# Altium schematic sheet Mosfets.SchDoc
size A4; SheetNumber: 6; SheetTotal: 9
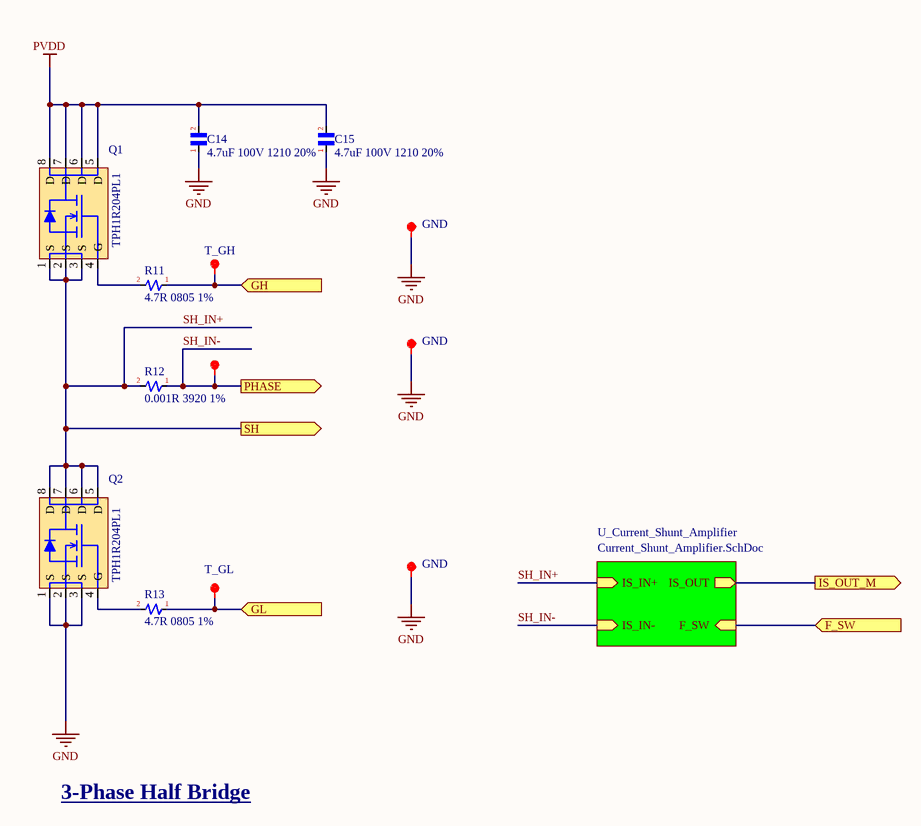
[diagram p0: Mosfets.SchDoc]

## Parts
C14  4.7uF 100V 1210 20%  [C_1210]
C15  4.7uF 100V 1210 20%  [C_1210]
Q1  TPH1R204PL1  [TRANS_STL60P4LLF6]
Q2  TPH1R204PL1  [TRANS_STL60P4LLF6]
R11  4.7R 0805 1%  [R_0805]
R12  0.001R 3920 1%  [R_3920]
R13  4.7R 0805 1%  [R_0805]
TP22  T_GH  [TP_1mm_SMD]  (graphical)
TP25  GND  [TP_1mm_SMD]  (graphical)
TP28  GND  [TP_1mm_SMD]  (graphical)
TP31  (no value)  [TP_1mm_SMD]  (graphical)
TP34  T_GL  [TP_1mm_SMD]  (graphical)
TP37  GND  [TP_1mm_SMD]  (graphical)

## Sub-sheets
U_Current_Shunt_Amplifier = Current_Shunt_Amplifier.SchDoc: IS_OUT (out), IS_IN+ (in), IS_IN- (in), F_SW (in)

## Ports
F_SW (in, see TurboSpin[3C], Current_Shunt_Amplifier[4C], Mcu[3C]), GH (in, see TurboSpin[3C]), GL (in, see TurboSpin[3C]), IS_OUT_M (out, see TurboSpin[3C]), PHASE (out, see TurboSpin[3C]), SH (out, see TurboSpin[3C])

## Nets
GND: C14.1 C15.1 Q2.1(S) Q2.2(S) Q2.3(S) TP25.1 TP28.1 TP37.1
PVDD: C14.2 C15.2 Q1.5(D) Q1.6(D) Q1.7(D) Q1.8(D)
F_SW: port F_SW, sheet U_Current_Shunt_Amplifier/F_SW
GH: R11.1 TP22.1 ; port GH
GL: R13.1 TP34.1 ; port GL
IS_OUT_M: port IS_OUT_M, sheet U_Current_Shunt_Amplifier/IS_OUT
SH_IN+: Q1.1(S) Q1.2(S) Q1.3(S) Q2.5(D) Q2.6(D) Q2.7(D) Q2.8(D) R12.2 ; port SH, sheet U_Current_Shunt_Amplifier/IS_IN+
SH_IN-: R12.1 TP31.1 ; port PHASE, sheet U_Current_Shunt_Amplifier/IS_IN-
NetQ1_4: Q1.4(G) R11.2
NetQ2_4: Q2.4(G) R13.2

## Notes on the sheet
- 3-Phase Half Bridge

## Library data of the parts
C14 C15 = Capacitor>> Non-Polar: CAP  0603 20%
Q1 Q2 = MOSFET_N>>ST130N6F7: N-channel 60 V, 3 mOhm typ., 130 A STripFET F7 Power MOSFET in a PowerFLAT 5x6 package; ComponentLink1Description: Datasheet; ComponentLink1URL: https://www.st.com/en/power-transistors/stl130n6f7.html#st_description_sec-nav-tab
R11-R13 = Resistor>> General Purpose: RES 0603 20%
TP22 TP25 TP28 TP31 TP34 TP37 = Test point TP